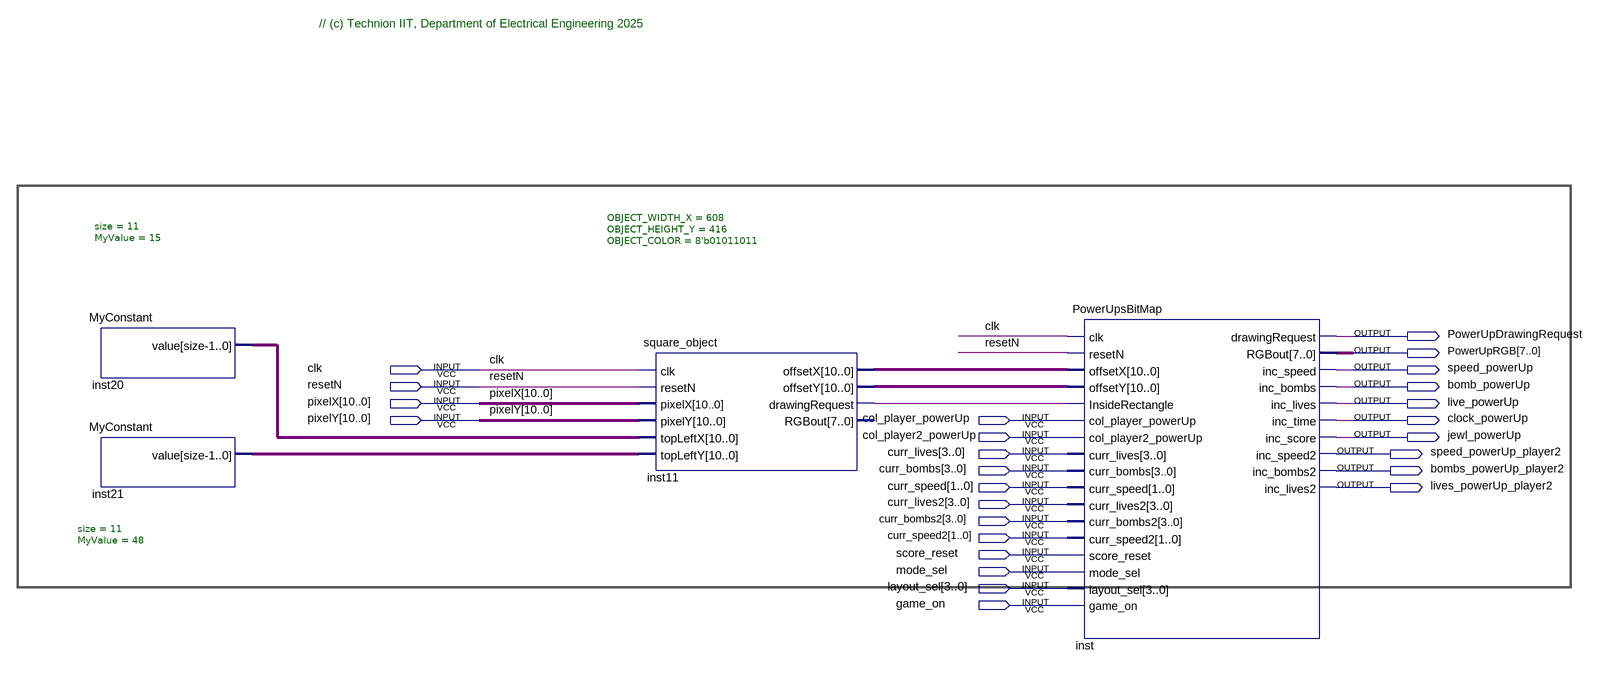
[diagram p0: schematic sheet]
// Quartus schematic PowerUps.bdf as structural Verilog: 4 symbols, 26 pins
module PowerUps (
  input  clk,
  input  resetN,
  input  [10:0] pixelX,
  input  [10:0] pixelY,
  input  col_player_powerUp,
  input  col_player2_powerUp,
  input  [3:0] curr_lives,
  input  [3:0] curr_bombs,
  input  [1:0] curr_speed,
  input  [3:0] curr_lives2,
  input  [3:0] curr_bombs2,
  input  [1:0] curr_speed2,
  input  score_reset,
  input  mode_sel,
  input  [3:0] layout_sel,
  input  game_on,
  output PowerUpDrawingRequest,
  output [7:0] PowerUpRGB,
  output speed_powerUp,
  output bomb_powerUp,
  output live_powerUp,
  output clock_powerUp,
  output jewl_powerUp,
  output speed_powerUp_player2,
  output bombs_powerUp_player2,
  output lives_powerUp_player2
);

  wire inst11_drawingrequest;
  wire [10:0] inst11_offsetx, inst11_offsety, inst20_value, inst21_value;

  MyConstant #(.size(11), .MyValue(15)) inst20 (.value(inst20_value));
  MyConstant #(.size(11), .MyValue(48)) inst21 (.value(inst21_value));
  square_object #(.OBJECT_WIDTH_X(608), .OBJECT_HEIGHT_Y(416), .OBJECT_COLOR(8'b01011011)) inst11 (
    .clk(clk), .resetN(resetN), .pixelX(pixelX), .pixelY(pixelY), .topLeftX(inst20_value),
    .topLeftY(inst21_value), .offsetX(inst11_offsetx), .offsetY(inst11_offsety),
    .drawingRequest(inst11_drawingrequest));  // open: RGBout
  PowerUpsBitMap inst (
    .clk(clk), .resetN(resetN), .offsetX(inst11_offsetx), .offsetY(inst11_offsety),
    .InsideRectangle(inst11_drawingrequest), .col_player_powerUp(col_player_powerUp),
    .col_player2_powerUp(col_player2_powerUp), .curr_lives(curr_lives), .curr_bombs(curr_bombs),
    .curr_speed(curr_speed), .curr_lives2(curr_lives2), .curr_bombs2(curr_bombs2), .curr_speed2(curr_speed2),
    .score_reset(score_reset), .mode_sel(mode_sel), .layout_sel(layout_sel), .game_on(game_on),
    .drawingRequest(PowerUpDrawingRequest), .RGBout(PowerUpRGB), .inc_speed(speed_powerUp),
    .inc_bombs(bomb_powerUp), .inc_lives(live_powerUp), .inc_time(clock_powerUp), .inc_score(jewl_powerUp),
    .inc_speed2(speed_powerUp_player2), .inc_bombs2(bombs_powerUp_player2), .inc_lives2(lives_powerUp_player2));

  // Notes on the sheet:
  //   // (c) Technion IIT, Department of Electrical Engineering 2025
endmodule
